# Altium schematic sheet 07_ADC.SchDoc: ADC
size A4; Date: 20/11/2014; Author: HuangRui <vowstar@gmail.com>; DrawnBy: JiYaping <jyp1817@gmail.com>; Organization: WWW.NODEMCU.COM
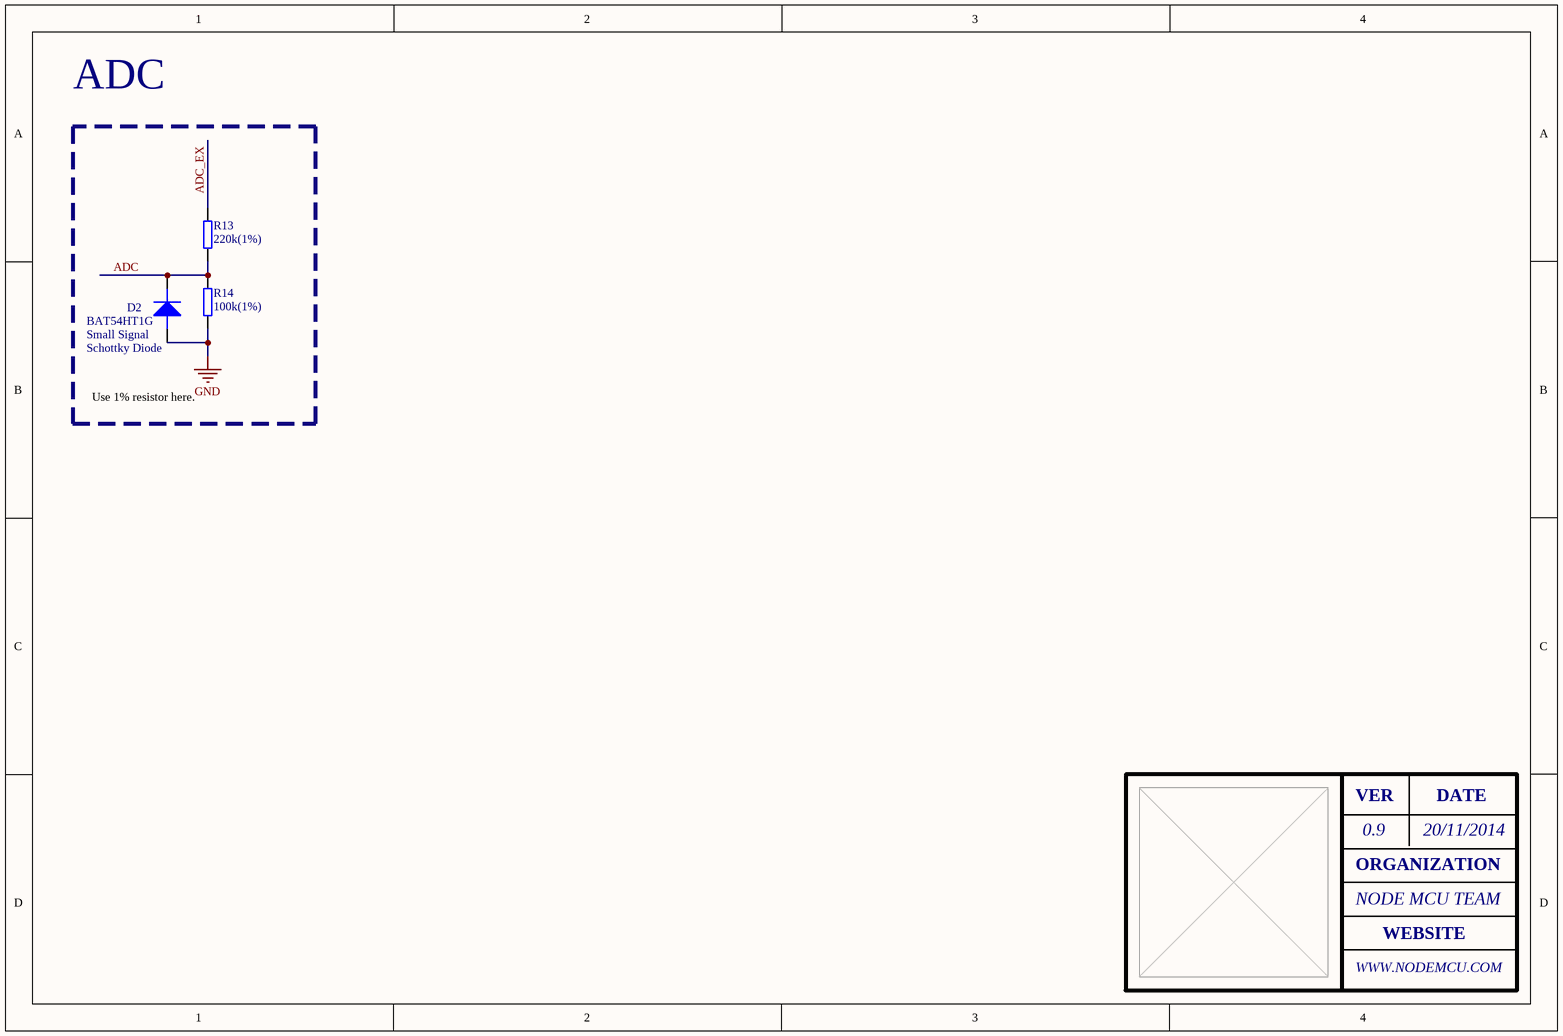
[diagram p0: 07_ADC.SchDoc]

## Parts
D2  BAT54HT1G  [SOD-323 2L]
R13  220k(1%)  [SMT_R_0402]
R14  100k(1%)  [SMT_R_0402]

## Nets
GND: D2.2(ANODE) R14.1
ADC: D2.1(cathode) R13.1 R14.2
ADC_EX: R13.2

## Notes on the sheet
- (near D2) Small Signal
- (near D2) Schottky Diode
- Use 1% resistor here.
- VER
- 0.9
- DATE
- ORGANIZATION
- NODE MCU TEAM
- WEBSITE

## Library data of the parts
D2 = BAT54HT1G: FAIRCHILD SEMICONDUCTOR - BAT54HT1G - DIODE, SCHOTTKY, 30V, SOD-323; Diode Configuration: Single; Repetitive Reverse Voltage Vrrm Max: 30; Forward Current If(AV): 200; Forward Voltage VF Max: 800; Forward Surge Current Ifsm Max: 600; No. of Pins: 2; Product Range: BAT54 Series; SVHC: No SVHC (15-Jun-2015); Reverse Recovery Time trr Max: 5ns<!--FANDB--><div class="features-and-benefits-container"><div class="features-and-benefits-description"><span class="features-benefits-value">The BAT54HT1G is a Schottky Barrier Diode for general usage and suitable for many different applications.</span></div><div class="features-and-benefits-list"><ul class="features-and-benefits-list-list"><li class="features-and-benefits-list-item">-65 to 150°C Storage temperature range</li><li class="features-and-benefits-list-item">-55 to 150; Supplier 1: Farnell; Manufacturer: FAIRCHILD SEMICONDUCTOR; Manufacturer Part Number: BAT54HT1G; RoHS: YES; Stock 1: 5495; Pricing 1: 1=0.0747, 250=0.065, 500=0.055, 1000=0.045, 3000=0.0349, 9000=0.0279 (GBP); Operating Temperature Max: 150; Diode Case Style: SOD-323; Packaging: Cut Tape; Automotive Qualification Standard: -; MSL: MSL 1 - Unlimited; ComponentLink1URL: http://www.farnell.com/datasheets/2251626.pdf; ComponentLink1Description: http://www.farnell.com/datasheets/2251626.pdf; Supplier Part Number 1: 2453769
R13 R14 = SMT_R_0402: Surface mount resistor 0402